# EAGLE design Templcd (EAGLE 6.2)
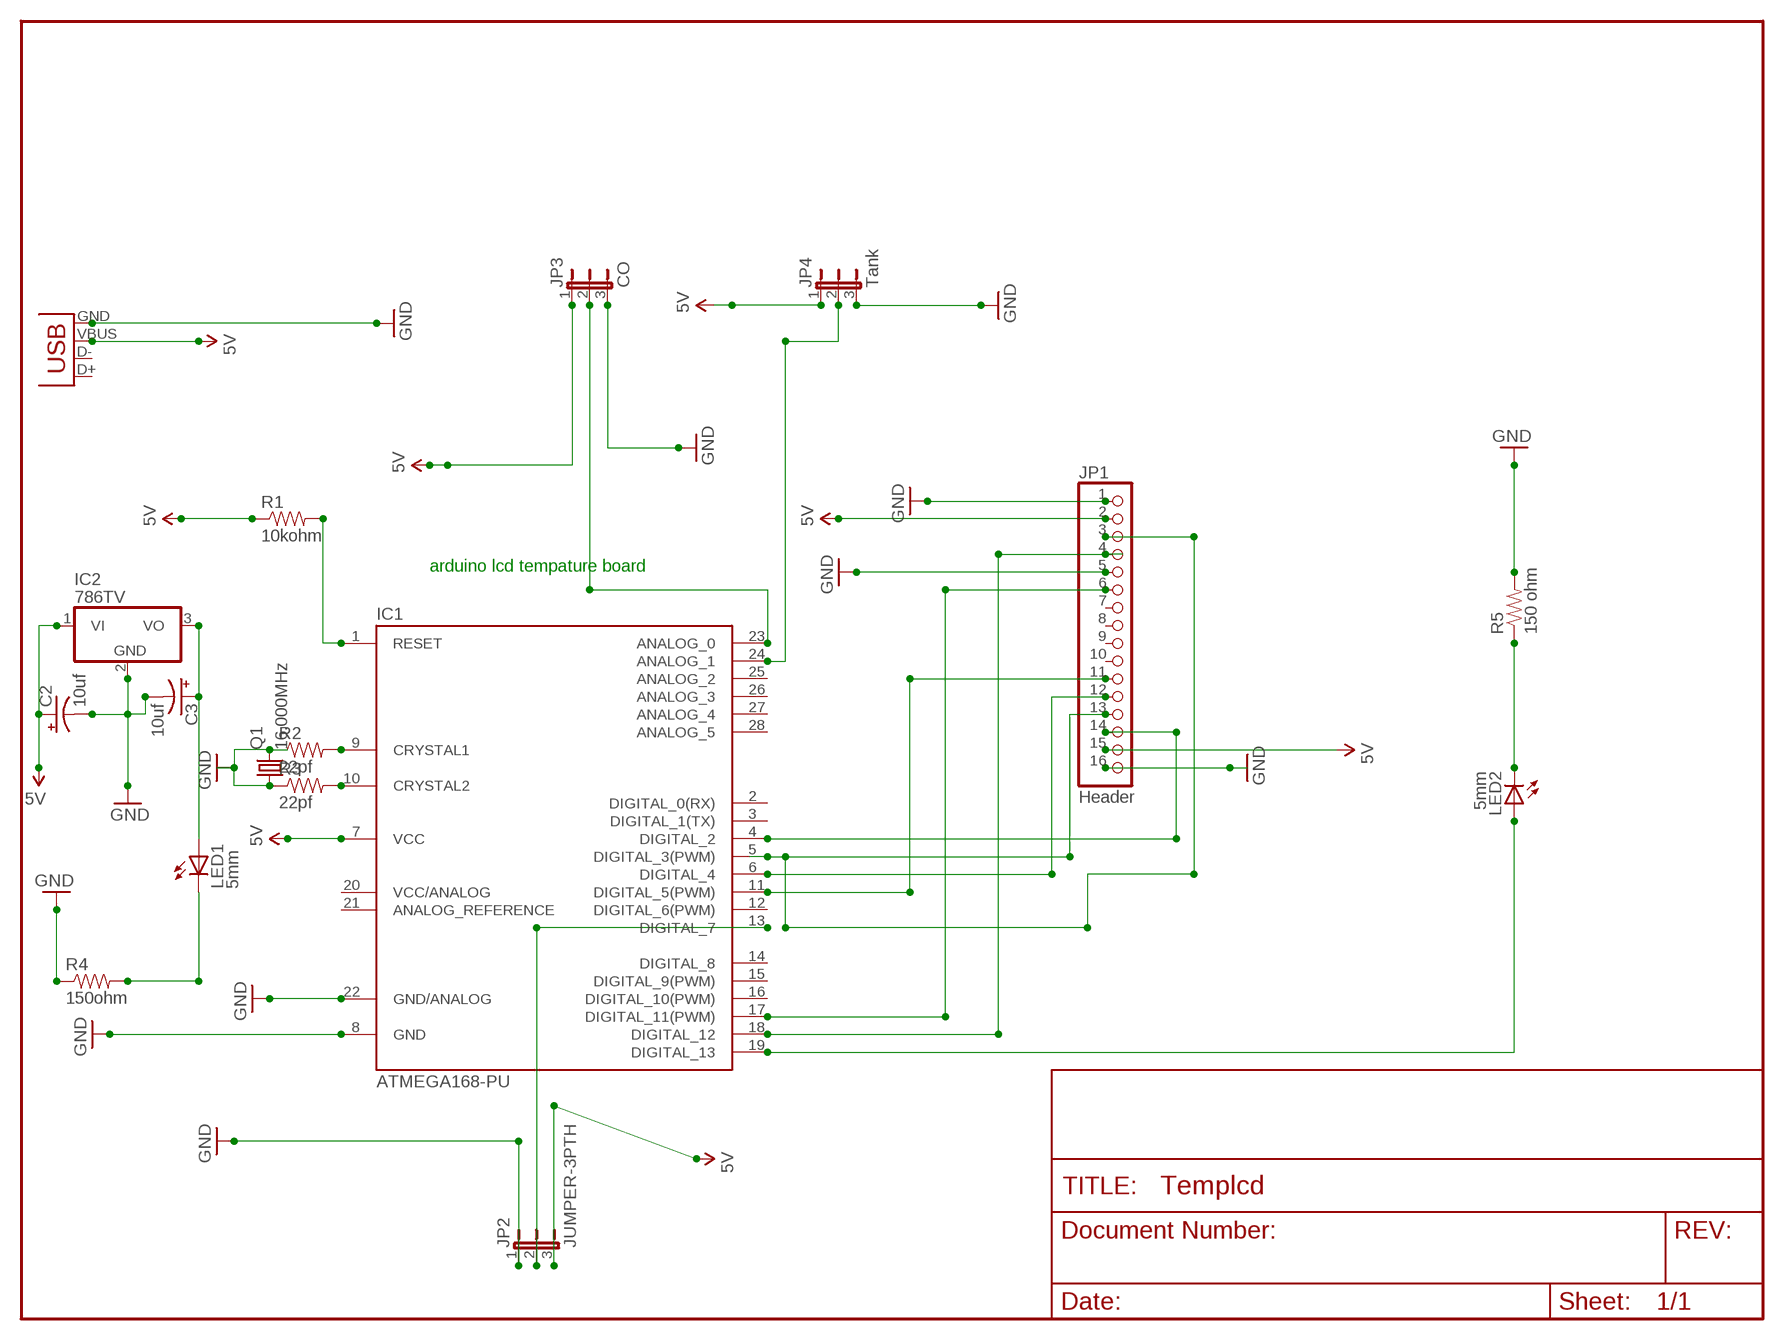
[diagram p0: schematic, sheet 1]

## Parts
C2  10uf  CAP_POLPTH1  [CPOL-RADIAL-100UF-25V]
C3  10uf  CAP_POLPTH1  [CPOL-RADIAL-100UF-25V]
IC1  ATMEGA168-PU  [DIL28-3]
IC2  786TV  [TO220V]
JP1  Header  PINHD-1X16  [1X16]
JP2  JUMPER-3PTH  [1X03]
JP3  CO  JP2W  [JP2W]
JP4  Tank  JP2W  [JP2W]
LED1  5mm  LED5MM  [LED5MM]
LED2  5mm  LED5MM  [LED5MM]
Q1  16.000MHz  CRYSTALHC49U-V  [HC49U-V]
R1  10kohm  RESISTORPTH1  [AXIAL-0.3]
R2  22pf  RESISTORPTH1  [AXIAL-0.3]
R3  22pf  RESISTORPTH1  [AXIAL-0.3]
R4  150ohm  RESISTORPTH1  [AXIAL-0.3]
R5  150 ohm  RESISTORPTH1  [AXIAL-0.3]
X1  USBPTH  [USB-B-PTH]

## Nets
5V: C2.1(+) IC1.7(VCC) IC2.1(VI) JP1.2 JP1.15 JP2.3 JP3.1 JP4.1 R1.P$1 X1.VBUS
GND: C2.2(-) C3.2(-) IC1.8(GND) IC1.22(GND/ANALOG) IC2.2(GND) JP1.1 JP1.5 JP1.16 JP2.1 JP3.3 JP4.3 Q1.1 Q1.2 R2.P$1 R3.P$1 R4.P$1 R5.P$2 X1.GND
N$1: LED1.K(C) R4.P$2
N$2: IC1.9(CRYSTAL1) R2.P$2
N$3: IC1.18(DIGITAL_12) JP1.4
N$4: IC1.17(DIGITAL_11(PWM)) JP1.6
N$5: IC1.11(DIGITAL_5(PWM)) JP1.11
N$6: IC1.6(DIGITAL_4) JP1.12
N$7: IC1.5(DIGITAL_3(PWM)) JP1.3 JP1.13
N$8: IC1.4(DIGITAL_2) JP1.14
N$9: IC1.10(CRYSTAL2) R3.P$2
N$10: IC1.1(RESET) R1.P$2
N$11: IC1.23(ANALOG_0) JP3.2
N$12: IC1.13(DIGITAL_7) JP2.2
N$13: C3.1(+) IC2.3(VO) LED1.A
N$14: IC1.24(ANALOG_1) JP4.2
N$18: IC1.19(DIGITAL_13) LED2.A
N$19: LED2.K(C) R5.P$1
Unconnected: IC1.2(DIGITAL_0(RX)) IC1.3(DIGITAL_1(TX)) IC1.12(DIGITAL_6(PWM)) IC1.14(DIGITAL_8) IC1.15(DIGITAL_9(PWM)) IC1.16(DIGITAL_10(PWM)) IC1.20(VCC/ANALOG) IC1.21(ANALOG_REFERENCE) IC1.25(ANALOG_2) IC1.26(ANALOG_3) IC1.27(ANALOG_4) IC1.28(ANALOG_5) JP1.7 JP1.8 JP1.9 JP1.10 X1.D+ X1.D-

## Notes on the sheet
- arduino lcd tempature board

## Library data of the parts
C2 C3 = SparkFun:CAP_POL: Capacitor Polarized These are standard SMD and PTH capacitors. Normally 10uF, 47uF, and 100uF in electrolytic and tantalum varieties. Always verify the external diameter of the through hole cap, it varies with capacity, voltage, and manufacturer. The EIA devices should be standard.
IC1 = Arduino-AVR:ATMEGA168-PU
IC2 = linear:78*: Positive VOLTAGE REGULATOR Source: http://cache.national.com/ds/LM/LM78L05.pdf http://www.fairchildsemi.com/ds/LM/LM7805.pdf
JP1 = pinhead:PINHD-1X16: PIN HEADER
JP2 = SparkFun:JUMPER-3
JP3 JP4 = jumper:JP2W: JUMPER
LED1 = led:LED: LED OSRAM: - CHIPLED LG R971, LG N971, LY N971, LG Q971, LY Q971, LO R971, LY R971 LH N974, LH R974 LS Q976, LO Q976, LY Q976 LO Q996 - Hyper CHIPLED LW Q18S LB Q993, LB Q99A, LB R99A - SideLED LS A670, LO A670, LY A670, LG A670, LP A670 LB A673, LV A673, LT A673, LW A673 LH A674 LY A675 LS A676, LA A676, LO A676, LY A676, LW A676 LS A679, LY A679, LG A679 - Hyper Micro SIDELED® LS Y876, LA Y876, LO Y876, LY Y876 LT Y87S - SmartLED LW L88C, LW L88S LB L89C, LB L89S, LG L890 LS L89K, LO L89K, LY L89K LS L896, LA L896, LO L896, LY L896 - TOPLED LS T670, LO T670, LY T670, LG T670, LP T670 LSG T670, LSP T670, LSY T670, LOP T670, LYG T670 LG T671, LOG T671, LSG T671 LB T673, LV T673, LT T673, LW T673 LH T674 LS T676, LA T676, LO T676, LY T676, LB T676, LH T676, LSB T676, LW T676 LB T67C, LV T67C, LT T67C, LS T67K, LO T67K, LY T67K, LW E67C LS E67B, LA E67B, LO E67B, LY E67B, LB E67C, LV E67C, LT E67C LW T67C LS T679, LY T679, LG T679 LS T770, LO T770, LY T770, LG T770, LP T770 LB T773, LV T773, LT T773, LW T773 LH T774 LS E675, LA E675, LY E675, LS T675 LS T776, LA T776, LO T776, LY T776, LB T776 LHGB T686 LT T68C, LB T68C - Hyper Mini TOPLED® LB M676 - Mini TOPLED Santana® LG M470 LS M47K, LO M47K, LY M47K Source: http://www.osram.convergy.de LUXEON: - LUMILED® LXK2-PW12-R00, LXK2-PW12-S00, LXK2-PW14-U00, LXK2-PW14-V00 LXK2-PM12-R00, LXK2-PM12-S00, LXK2-PM14-U00 LXK2-PE12-Q00, LXK2-PE12-R00, LXK2-PE12-S00, LXK2-PE14-T00, LXK2-PE14-U00 LXK2-PB12-K00, LXK2-PB12-L00, LXK2-PB12-M00, LXK2-PB14-N00, LXK2-PB14-P00, LXK2-PB14-Q00 LXK2-PR12-L00, LXK2-PR12-M00, LXK2-PR14-Q00, LXK2-PR14-R00 LXK2-PD12-Q00, LXK2-PD12-R00, LXK2-PD12-S00 LXK2-PH12-R00, LXK2-PH12-S00 LXK2-PL12-P00, LXK2-PL12-Q00, LXK2-PL12-R00 Source: www.luxeon.com KINGBRIGHT: KA-3528ASYC Source: www.kingbright.com
LED2 = SparkFun:LED: LEDs Standard schematic elements and footprints for 5mm, 3mm, 1206, and 0603 sized LEDs. 5mm - Spark Fun Electronics SKU : COM-00529 (and others)
Q1 = crystal:CRYSTAL: CRYSTAL; OC_FARNELL: 1666969; OC_NEWARK: unknown
R1-R5 = SparkFun:RESISTOR: Resistor Basic schematic elements and footprints for 0603, 1206, and PTH 1/10th watt (small) resistors.
X1 = SparkFun:USB: USB Connectors USB-B-PTH is fully proven SKU : PRT-00139 USB-miniB is fully proven SKU : PRT-00587 USB-A-PCB is untested. USB-A-H is throughly reviewed, but untested. Spark Fun Electronics SKU : PRT-00437 USB-B-SMT is throughly reviewed, but untested. Needs silkscreen touching up. USB-A-S has not been used/tested USB-MB-H has not been used/tested

## Board
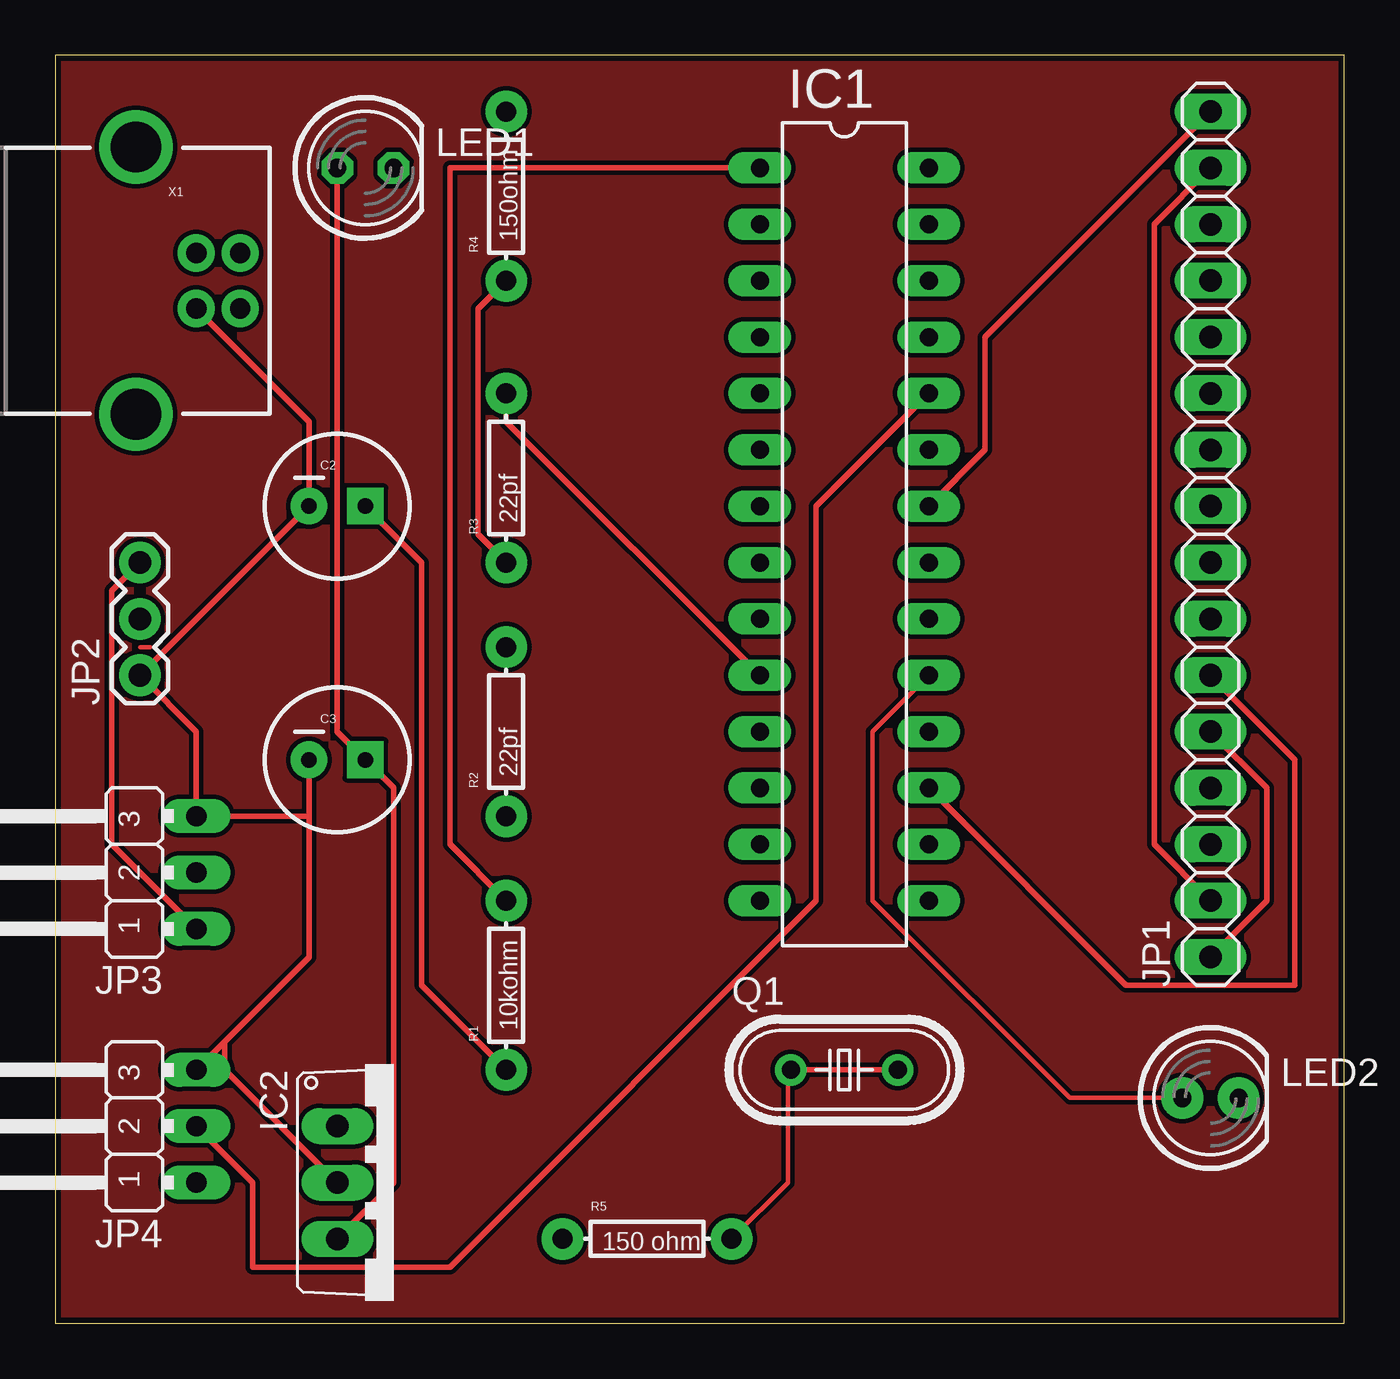
[diagram p1: board, top side]
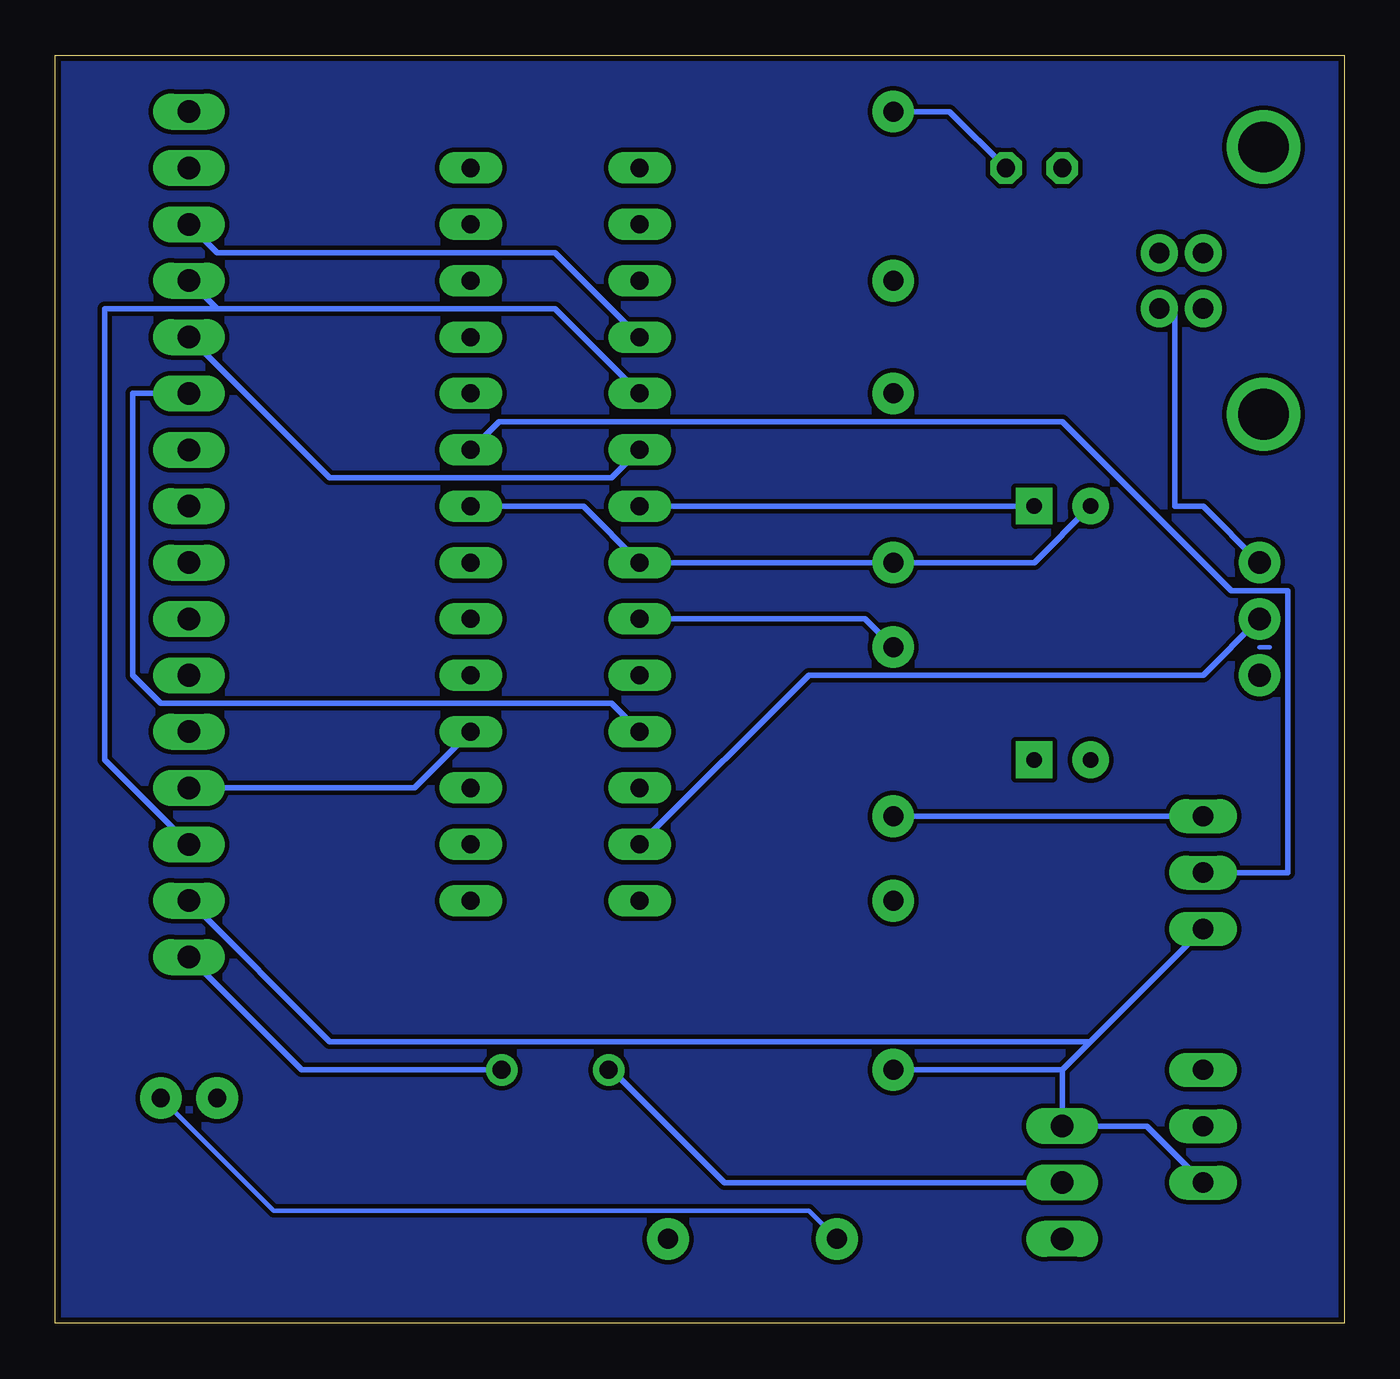
[diagram p2: board, bottom side, seen from below]

Size 58.09 x 57.14 mm. Coordinates in mm from the lower left corner, seen from the top.
Outline: 0,0 58.09,0 58.09,57.14 0,57.14 0,0
Copper layers (1*16): Top 0.035mm / dielectric 1.5mm / Bottom 0.035mm
Design rules: minimum track width 8mil, minimum drill 20mil, track to track 8mil, track to pad 8mil, pad to pad 8mil, via to via 8mil, smd to smd 8mil, copper to edge 10mil, drill to drill 8mil, minimum pad ring 12mil, minimum via ring 10mil, stop-mask expansion 4mil, vias tented up to drill 25mil, thermal gap 10mil

### Footprints (pad centres in the part's own frame; a part is rotated, then mirrored left to right if it is on the bottom)
CPOL-RADIAL-100UF-25V = drill 0.7 pad 1.651 square: 1 1.27,0 | drill 0.7 pad 1.651: 2 -1.27,0
DIL28-3 = drill 0.813 long: 1 -16.51,-3.81; 2 -13.97,-3.81; 3 -11.43,-3.81; 4 -8.89,-3.81; 5 -6.35,-3.81; 6 -3.81,-3.81; 7 -1.27,-3.81; 8 1.27,-3.81; 9 3.81,-3.81; 10 6.35,-3.81; 11 8.89,-3.81; 12 11.43,-3.81; 13 13.97,-3.81; 14 16.51,-3.81; 15 16.51,3.81; 16 13.97,3.81; 17 11.43,3.81; 18 8.89,3.81; 19 6.35,3.81; 20 3.81,3.81; 21 1.27,3.81; 22 -1.27,3.81; 23 -3.81,3.81; 24 -6.35,3.81; 25 -8.89,3.81; 26 -11.43,3.81; 27 -13.97,3.81; 28 -16.51,3.81
TO220V = drill 1.016 long: 1 -2.54,-2.54; 2 0,-2.54; 3 2.54,-2.54
1X16 = drill 1.016 long: 1 -19.05,0; 2 -16.51,0; 3 -13.97,0; 4 -11.43,0; 5 -8.89,0; 6 -6.35,0; 7 -3.81,0; 8 -1.27,0; 9 1.27,0; 10 3.81,0; 11 6.35,0; 12 8.89,0; 13 11.43,0; 14 13.97,0; 15 16.51,0; 16 19.05,0
1X03 = drill 1.016 pad 1.88: 1 0,0; 2 2.54,0; 3 5.08,0
JP2W = drill 0.914 long: 1 -2.54,-1.27; 2 0,-1.27; 3 2.54,-1.27
LED5MM = drill 0.813 octagon: A -1.27,0; K 1.27,0
LED5MM' = drill 0.813 pad 1.88: A -1.27,0; K 1.27,0
HC49U-V = drill 0.813: 1 -2.413,0; 2 2.413,0
AXIAL-0.3 = drill 0.9 pad 1.88: P$1 -3.81,0; P$2 3.81,0
USB-B-PTH = drill 0.914 pad 1.676: D+ 0,1.25; D- 1.981,1.25; GND 0,-1.25; VBUS 1.981,-1.25 | drill 2.286: P$1 -2.718,-6.02; P$2 -2.718,6.02

### Placement (x,y rotation side)
C2  12.7,36.83 0 top
C3  12.7,25.4 0 top
IC1  35.56,35.56 270 top
IC2  15.24,6.35 270 top
JP1  52.07,35.56 90 top
JP2  3.81,29.21 90 top
JP3  5.08,20.32 90 top
JP4  5.08,8.89 90 top
LED1  13.97,52.07 0 top
LED2  5mm  [LED5MM']  52.07,10.16 0 top
Q1  35.56,11.43 0 top
R1  20.32,15.24 90 top
R2  20.32,26.67 90 top
R3  20.32,38.1 90 top
R4  20.32,50.8 90 top
R5  26.67,3.81 0 top
X1  6.35,46.99 0 top

### Tracks (layer width: path | path; a pad name or v marks a point on that pad's centre or on a via)
5V
  Top 0.254: JP1.15 49.53,49.53 49.53,21.59 JP1.2 | JP2.3 2.54,33.02 2.54,21.59 JP3.1 | C2.1 16.51,34.29 16.51,15.24 R1.P$1
  Bottom 0.254: C2.1 IC1.7 | JP2.3 6.35,36.83 7.62,36.83 7.62,45.72 X1.VBUS | JP4.1 8.89,8.89 IC2.1 12.7,11.43 | 12.7,11.43 11.43,12.7 | 11.43,12.7 JP3.1 | R1.P$1 12.7,11.43 | JP1.2 45.72,12.7 11.43,12.7
GND
  Top 0.203: R5.P$2 33.02,6.35 33.02,11.43
  Top 0.254: JP1.16 41.91,44.45 41.91,39.37 IC1.22 | 33.02,11.43 Q1.1 Q1.2 38.1,11.43 | JP1.5 54.61,24.13 54.61,19.05 JP1.1 | X1.GND 6.35,45.72 11.43,40.64 C2.2 JP2.1 6.35,26.67 JP3.3 11.43,22.86 | R4.P$1 19.05,45.72 19.05,35.56 R3.P$1 | 7.62,12.7 11.43,16.51 11.43,22.86 | 7.62,12.7 JP4.3 | C3.2 11.43,22.86 | IC2.2 7.62,11.43 7.62,12.7
  Bottom 0.254: IC1.22 34.29,36.83 IC1.8 R3.P$1 13.97,34.29 C2.2 | JP1.1 46.99,11.43 Q1.2 | JP3.3 R2.P$1 | IC2.2 27.94,6.35 33.02,11.43 Q1.1
N$1
  Bottom 0.254: LED1.K 17.78,54.61 R4.P$2
N$2
  Bottom 0.254: IC1.9 21.59,31.75 R2.P$2
N$3
  Bottom 0.254: IC1.18 41.91,24.13 JP1.4
N$4
  Top 0.254: IC1.17 48.26,15.24 55.88,15.24 55.88,25.4 JP1.6
N$5
  Bottom 0.254: IC1.11 33.02,27.94 53.34,27.94 54.61,29.21 54.61,41.91 JP1.11
N$6
  Bottom 0.254: IC1.6 33.02,38.1 45.72,38.1 JP1.12
N$7
  Bottom 0.254: IC1.5 35.56,45.72 50.8,45.72 | JP1.13 50.8,45.72 | JP1.3 55.88,25.4 55.88,45.72 50.8,45.72
N$8
  Bottom 0.254: IC1.4 35.56,48.26 50.8,48.26 JP1.14
N$9
  Top 0.254: IC1.10 20.32,40.64 R3.P$2
N$10
  Top 0.254: IC1.1 17.78,52.07 17.78,21.59 R1.P$2
N$11
  Bottom 0.254: IC1.23 38.1,40.64 12.7,40.64 5.08,33.02 2.54,33.02 2.54,20.32 JP3.2
N$12
  Bottom 0.254: IC1.13 24.13,29.21 6.35,29.21 JP2.2
N$13
  Top 0.254: LED1.A 12.7,26.67 C3.1 15.24,24.13 15.24,6.35 IC2.3
N$14
  Top 0.254: IC1.24 34.29,36.83 34.29,19.05 17.78,2.54 8.89,2.54 8.89,6.35 JP4.2
N$15
  Bottom 0.203: 3.81,30.48 3.36,30.48
N$16
  Top 0.203: 3.81,30.48 4.26,30.48
N$17
  pour Bottom: 0,57.15 0,0 58.42,0 58.42,57.15
N$18
  Top 0.203: IC1.19 36.83,26.67 36.83,19.05 45.72,10.16 LED2.A
N$19
  Bottom 0.203: R5.P$1 24.13,5.08 48.26,5.08 LED2.K
N$20
  pour Top: 0,57.15 0,0 58.42,0 58.42,57.15